# EAGLE schematic Robotics (EAGLE 9.7.0)
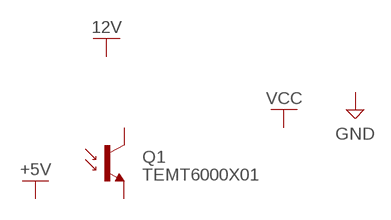
[diagram p0: schematic, sheet 1]

## Parts
Q1  TEMT6000X01  [1206_TEMT6000X01]
Unconnected: Q1.P$1(E) Q1.P$3(C)

## Library data of the parts
Q1 = Sensor:TEMT6000X01: Ambient Light Sensor Datasheet <https://www.vishay.com/docs/81579/temt6000.pdf>; CATEGORY: Sensors & Transducers; DATASHEET: https://www.vishay.com/docs/81579/temt6000.pdf; DESCRIPTION: Phototransistors 570nm Top View 1206 (3216 Metric); MANUFACTURER: Vishay Semiconductor Opto Division; MPN: TEMT6000X01; OPERATING_TEMPERATURE: -40°C ~ 100°C; PACKAGE_SIZE: 1206; PACKAGE_TYPE: SMD; PART_STATUS: ACTIVE; ROHS: COMPLIANT; SERIES: TEMT6000; SUBCATEGORY: Optical Sensors; TYPE: Phototransistors